# EasyEDA schematic SCH_skymest-2026.06.07_2026-06-14.json
TITLE: Sheet_1; REV: 1.0; Date: 2026-06-07; Sheet: 1/1; Drawn By: Yasir Faiz Ahmed; Company: Your Company
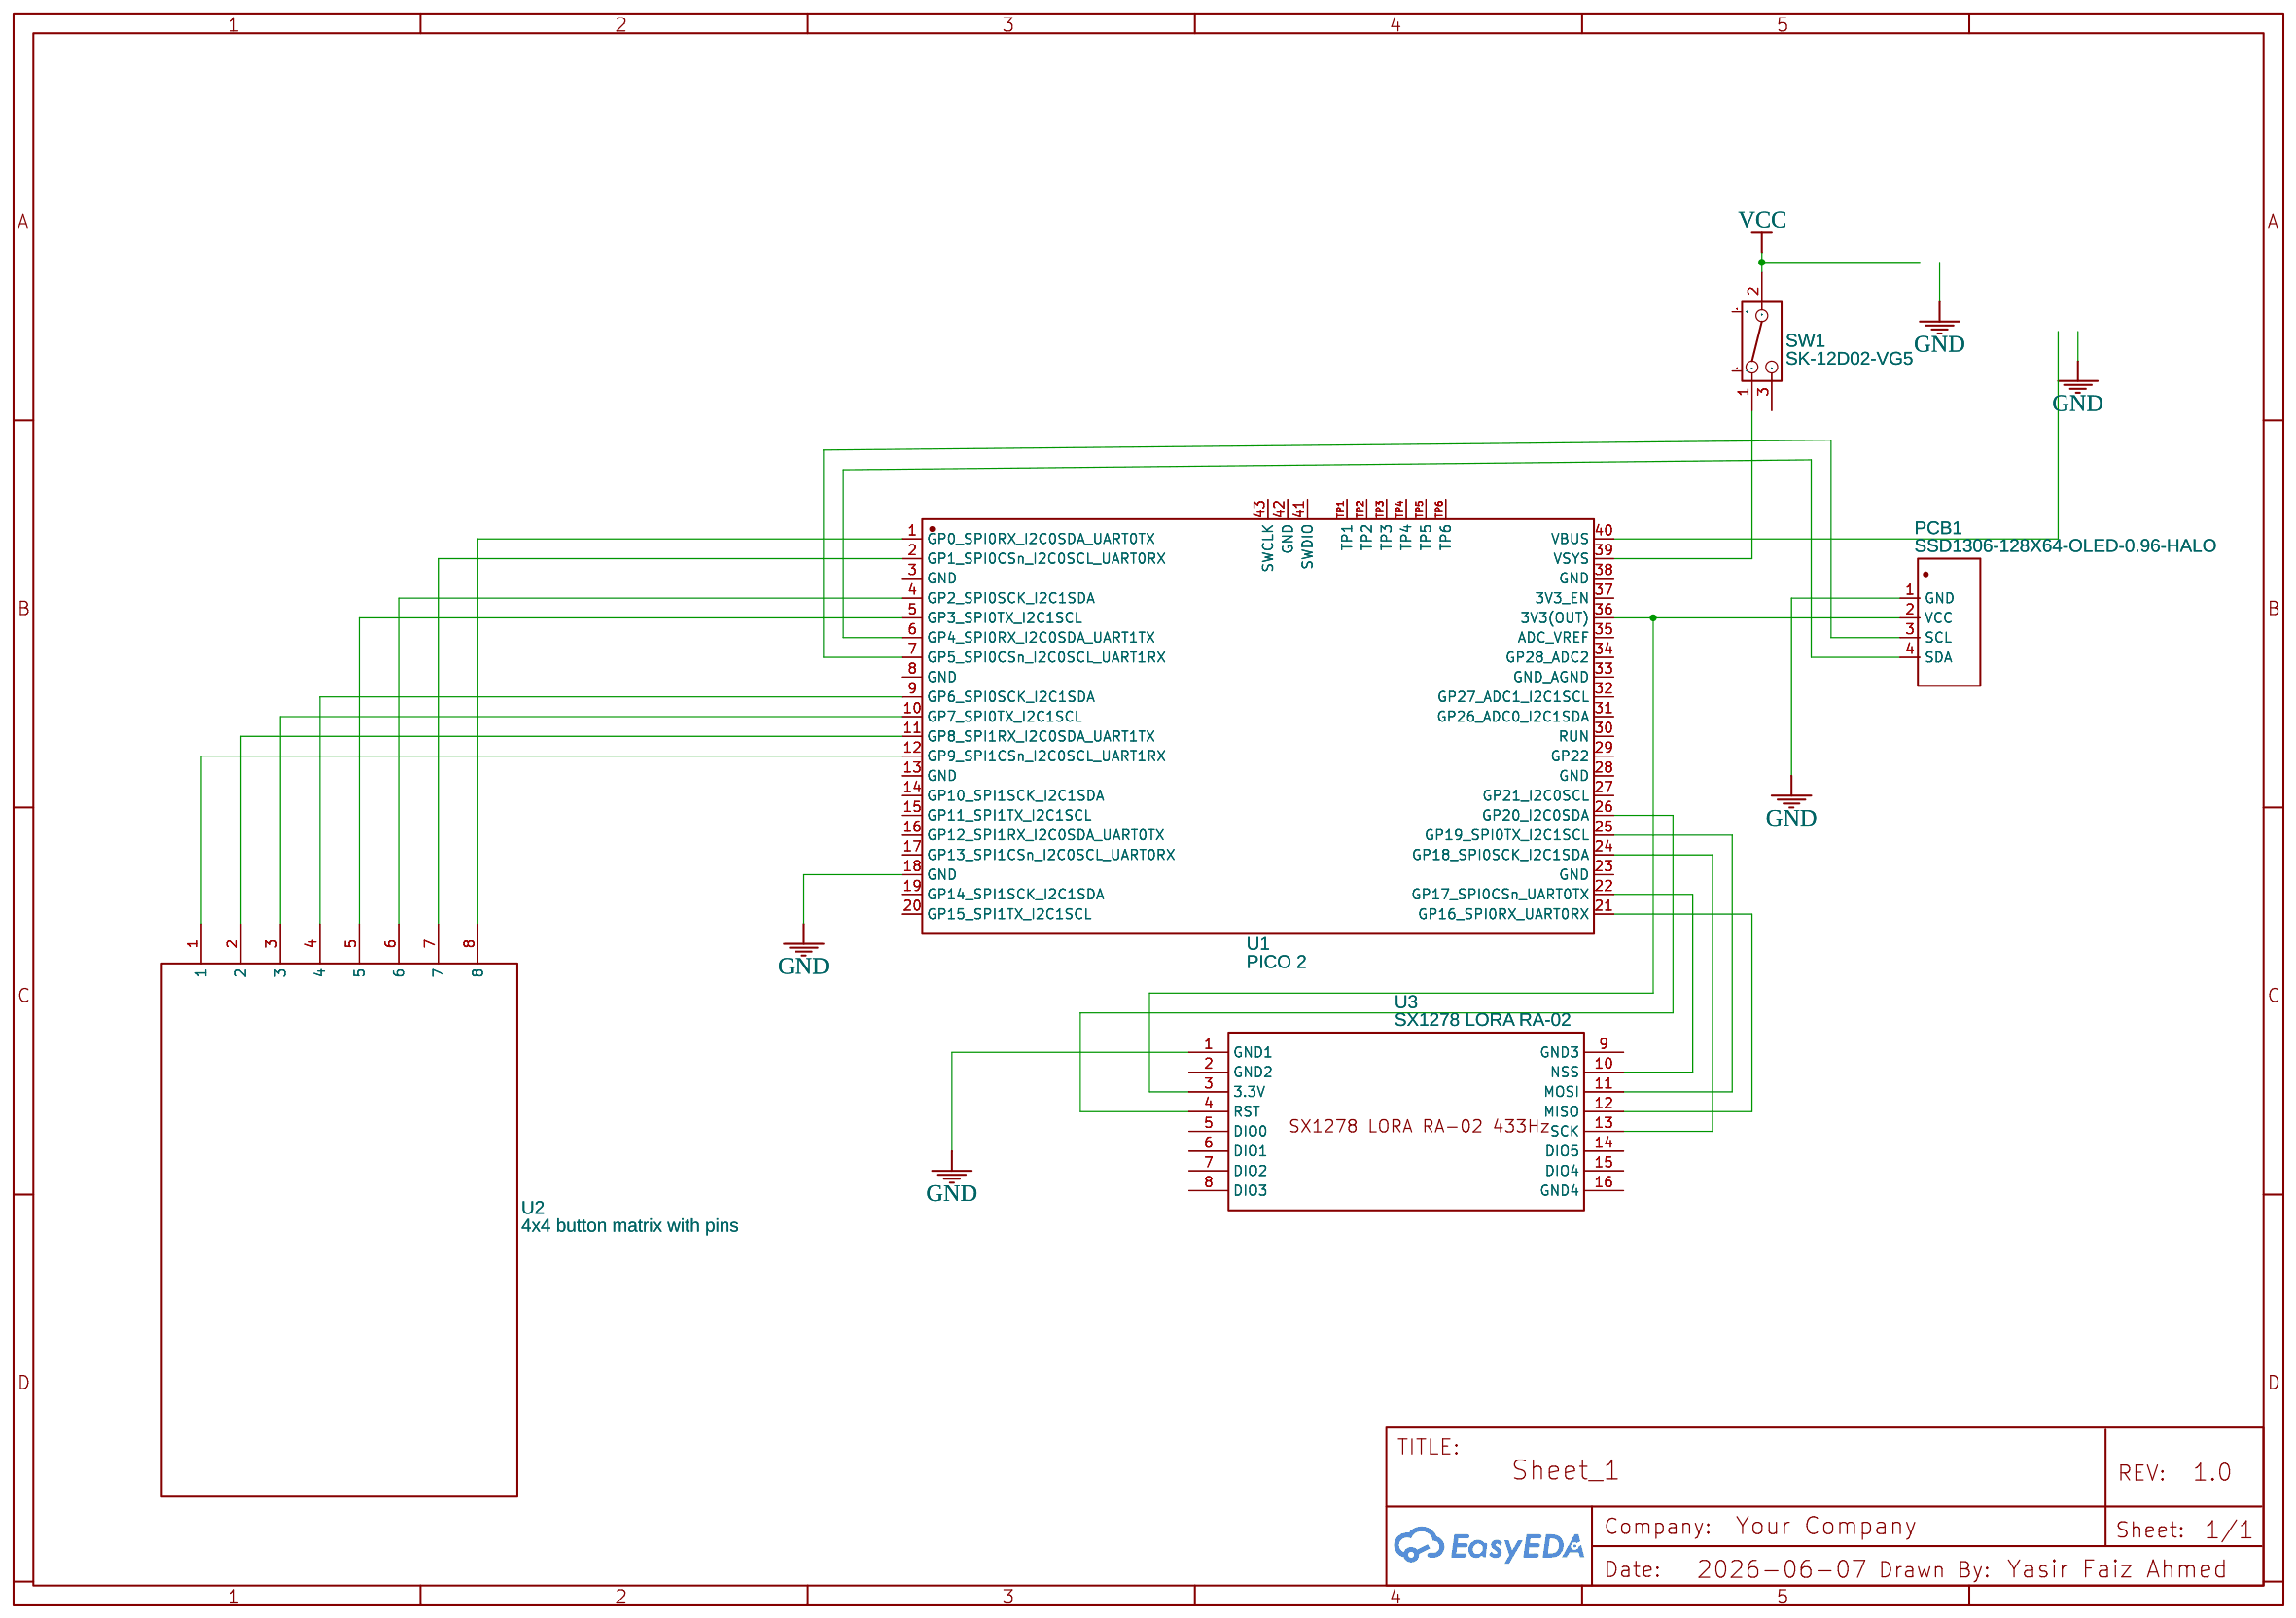
[diagram p0: schematic sheet]

## Parts
PCB1  SSD1306-128X64-OLED-0.96-HALO  [SSD1306GD]
SW1  SK-12D02-VG5  [SW-TH_SK-12D02VG3]
U1  PICO 2  [COMM-SMD_L51.0-W21.0-P2.54_SC0916]
U2  4x4 button matrix with pins  [4X4 BUTTON MATRIX WITH PINS]
U3  SX1278 LORA RA-02  [SX1278 LORA RA-02]

## Library data of the parts
PCB1 = SSD1306-128X64-OLED-0.96-HALO: sourceId: wICUcuL3l; Contributor: robonline
SW1 = SK-12D02-VG5: Supplier: LCSC; Supplier Part: C136722; Manufacturer: Rectangular Connectors - Contacts; Contributor: LCSC
U1 = PICO 2: Supplier: LCSC; Supplier Part: C41407547; Manufacturer: Raspberry Pi(树莓派); Manufacturer Part: Pico 2; JLCPCB Part Class: Extended Part; Contributor: lcsc
U2 = 4x4 button matrix with pins: Contributor: yasirfaizahmed.n
U3 = SX1278 LORA RA-02: Supplier: Onixo; Contributor: shapna.khatun1960

## Nets
GND: PCB1.1(GND) U1.18(GND) U3.1(GND1)
VCC: SW1.2
Net-(PCB1-2): PCB1.2(VCC) U1.36(3V3(OUT)) U3.3(3.3V)
Net-(PCB1-3): PCB1.3(SCL) U1.7(GP5_SPI0CSn_I2C0SCL_UART1RX)
Net-(PCB1-4): PCB1.4(SDA) U1.6(GP4_SPI0RX_I2C0SDA_UART1TX)
Net-(SW1-1): SW1.1 U1.39(VSYS)
Net-(U1-1): U1.1(GP0_SPI0RX_I2C0SDA_UART0TX) U2.8
Net-(U1-2): U1.2(GP1_SPI0CSn_I2C0SCL_UART0RX) U2.7
Net-(U1-4): U1.4(GP2_SPI0SCK_I2C1SDA) U2.6
Net-(U1-5): U1.5(GP3_SPI0TX_I2C1SCL) U2.5
Net-(U1-9): U1.9(GP6_SPI0SCK_I2C1SDA) U2.4
Net-(U1-10): U1.10(GP7_SPI0TX_I2C1SCL) U2.3
Net-(U1-11): U1.11(GP8_SPI1RX_I2C0SDA_UART1TX) U2.2
Net-(U1-12): U1.12(GP9_SPI1CSn_I2C0SCL_UART1RX) U2.1
Net-(U1-21): U1.21(GP16_SPI0RX_UART0RX) U3.12(MISO)
Net-(U1-22): U1.22(GP17_SPI0CSn_UART0TX) U3.10(NSS)
Net-(U1-24): U1.24(GP18_SPI0SCK_I2C1SDA) U3.13(SCK)
Net-(U1-25): U1.25(GP19_SPI0TX_I2C1SCL) U3.11(MOSI)
Net-(U1-26): U1.26(GP20_I2C0SDA) U3.4(RST)

Not connected (* = marked no-connect by the designer): SW1 3 4 5; U1 3(GND) 8(GND) 13(GND) 14(GP10_SPI1SCK_I2C1SDA) 15(GP11_SPI1TX_I2C1SCL) 16(GP12_SPI1RX_I2C0SDA_UART0TX) 17(GP13_SPI1CSn_I2C0SCL_UART0RX) 19(GP14_SPI1SCK_I2C1SDA) 20(GP15_SPI1TX_I2C1SCL) 23(GND) 27(GP21_I2C0SCL) 28(GND) 29(GP22) 30(RUN) 31(GP26_ADC0_I2C1SDA) 32(GP27_ADC1_I2C1SCL) 33(GND_AGND) 34(GP28_ADC2) 35(ADC_VREF) 37(3V3_EN) 38(GND) 40(VBUS) 41(SWDIO) 42(GND) 43(SWCLK) TP1 TP2 TP3 TP4 TP5 TP6; U3 2(GND2) 5(DIO0) 6(DIO1) 7(DIO2) 8(DIO3) 9(GND3) 14(DIO5) 15(DIO4) 16(GND4)
